# Altium schematic sheet Sheet1.SchDoc
size A4; SheetNumber: 1; SheetTotal: 1
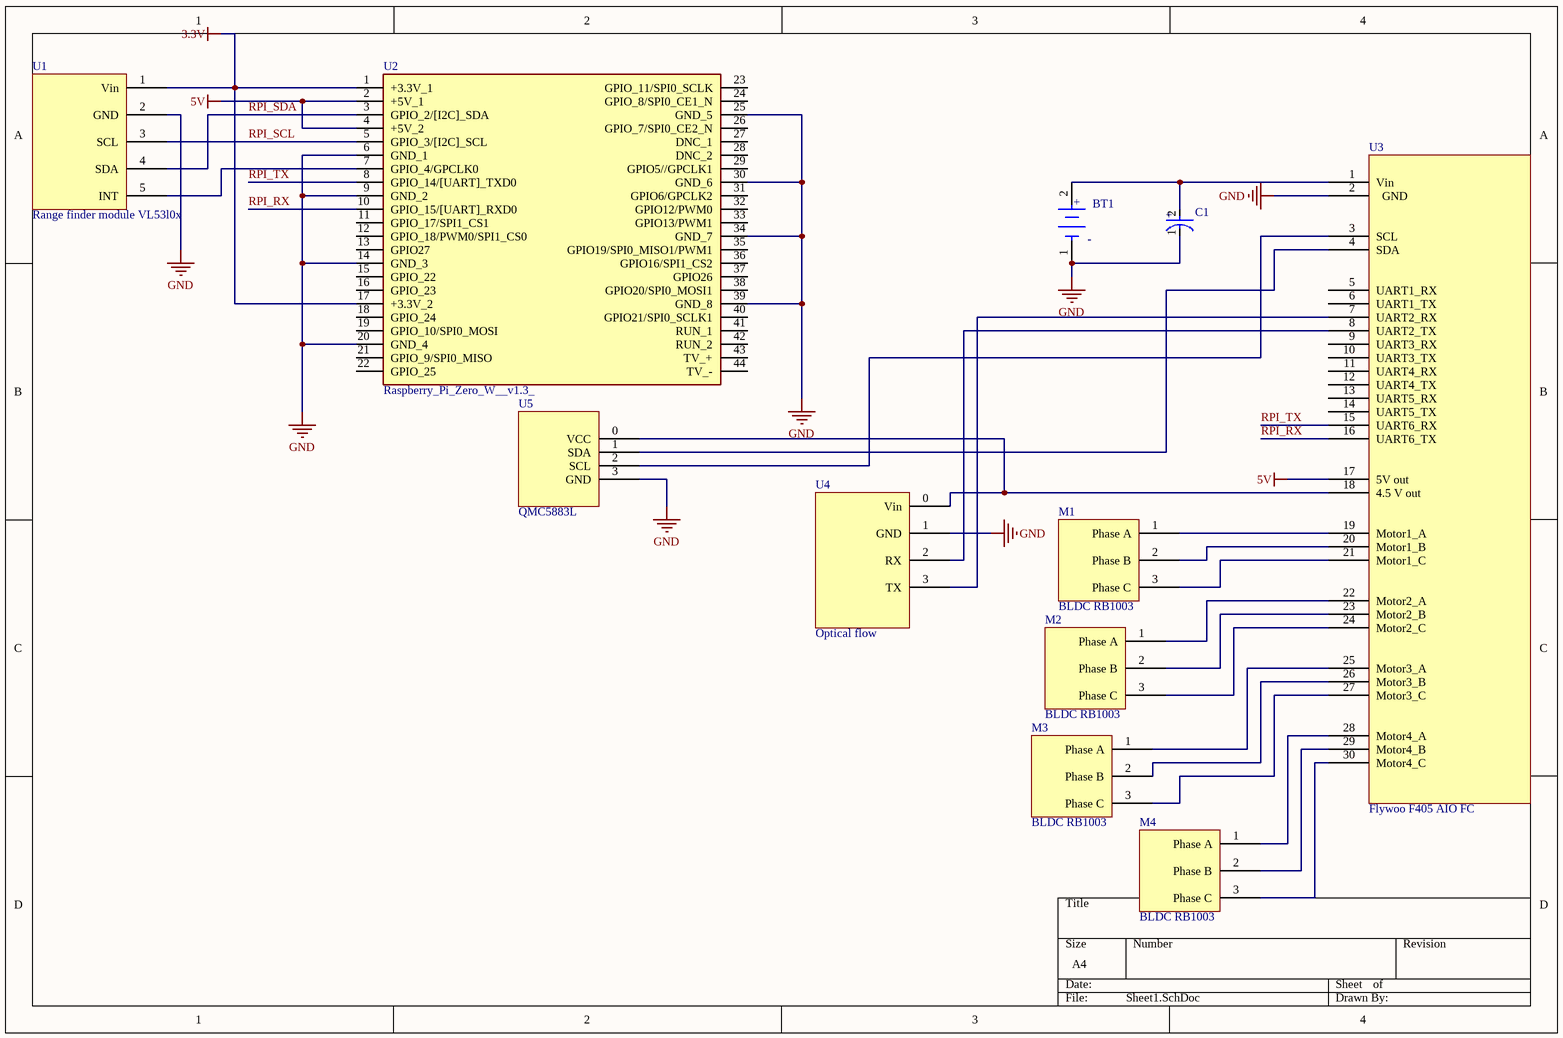
[diagram p0: Sheet1.SchDoc]

## Parts
BT1  S8411-45R  [FP-S8411-45R-MFG]  (value not drawn)
C1  EEEFK1H101P  [FP-FKF-MFG]  (value not drawn)
M1  BLDC RB1003
M2  BLDC RB1003
M3  BLDC RB1003
M4  BLDC RB1003
U1  Range finder module VL53l0x
U2  Raspberry_Pi_Zero_W__v1.3_  [RASPBERRYPIZEROWV13]
U3  Flywoo F405 AIO FC
U4  Optical flow
U5  QMC5883L

## Nets
3.3V: U1.1(Vin) U2.1(+3.3V_1) U2.17(+3.3V_2)
5V: U2.2(+5V_1) U2.4(+5V_2) U3.17(5V_out)
GND: BT1.1(C) C1.1(C) U1.2(GND) U2.6(GND_1) U2.9(GND_2) U2.14(GND_3) U2.20(GND_4) U2.25(GND_5) U2.30(GND_6) U2.34(GND_7) U2.39(GND_8) U3.2(GND) U4.1(GND) U5.3(GND)
RPI_RX: U2.10(GPIO_15/[UART]_RXD0) U3.16(UART6_TX)
RPI_SCL: U1.3(SCL) U2.5(GPIO_3/[I2C]_SCL)
RPI_SDA: U1.4(SDA) U2.3(GPIO_2/[I2C]_SDA)
RPI_TX: U2.8(GPIO_14/[UART]_TXD0) U3.15(UART6_RX)
NetBT1_2: BT1.2(A) C1.2(A) U3.1(Vin)
NetM1_1: M1.1(Phase_A) U3.19(Motor1_A)
NetM1_2: M1.2(Phase_B) U3.20(Motor1_B)
NetM1_3: M1.3(Phase_C) U3.21(Motor1_C)
NetM2_1: M2.1(Phase_A) U3.22(Motor2_A)
NetM2_2: M2.2(Phase_B) U3.23(Motor2_B)
NetM2_3: M2.3(Phase_C) U3.24(Motor2_C)
NetM3_1: M3.1(Phase_A) U3.25(Motor3_A)
NetM3_2: M3.2(Phase_B) U3.26(Motor3_B)
NetM3_3: M3.3(Phase_C) U3.27(Motor3_C)
NetM4_1: M4.1(Phase_A) U3.28(Motor4_A)
NetM4_2: M4.2(Phase_B) U3.29(Motor4_B)
NetM4_3: M4.3(Phase_C) U3.30(Motor4_C)
NetU1_5: U1.5(INT) U2.7(GPIO_4/GPCLK0)
NetU3_3: U3.3(SCL) U5.2(SCL)
NetU3_4: U3.4(SDA) U5.1(SDA)
NetU3_7: U3.7(UART2_RX) U4.3(TX)
NetU3_8: U3.8(UART2_TX) U4.2(RX)
NetU3_18: U3.18(4.5_V_out) U4.0(Vin) U5.0(VCC)

Not connected (* = marked no-connect by the designer): U2 11(GPIO_17/SPI1_CS1) 12(GPIO_18/PWM0/SPI1_CS0) 13(GPIO27) 15(GPIO_22) 16(GPIO_23) 18(GPIO_24) 19(GPIO_10/SPI0_MOSI) 21(GPIO_9/SPI0_MISO) 22(GPIO_25) 23(GPIO_11/SPI0_SCLK) 24(GPIO_8/SPI0_CE1_N) 26(GPIO_7/SPI0_CE2_N) 27(DNC_1) 28(DNC_2) 29(GPIO5//GPCLK1) 31(GPIO6/GPCLK2) 32(GPIO12/PWM0) 33(GPIO13/PWM1) 35(GPIO19/SPI0_MISO1/PWM1) 36(GPIO16/SPI1_CS2) 37(GPIO26) 38(GPIO20/SPI0_MOSI1) 40(GPIO21/SPI0_SCLK1) 41(RUN_1) 42(RUN_2) 43(TV_+) 44(TV_-); U3 5(UART1_RX) 6(UART1_TX) 9(UART3_RX) 10(UART3_TX) 11(UART4_RX) 12(UART4_TX) 13(UART5_RX) 14(UART5_TX)

## Notes on the sheet
- (in symbol CMP-2000-06208-3) +
- (in symbol CMP-15817-000007-1) +; -

## Library data of the parts
BT1 = CMP-15817-000007-1: BATTERY HOLDER COIN 12MM SMD; Number of Batteries: 1; Material: Polyphenylene; Case/Package: SMD/SMT; Number of Cells: 1; Min Operating Temperature: -55°C; Termination: SMD/SMT; REACH SVHC: No SVHC; Contact Plating: Bronze; Package Quantity: 500; Max Operating Temperature: 105°C; Mount: Surface Mount; Packaging: Tape and Reel
C1 = CMP-2000-06208-3: CAP ALUM 100UF 20% 50V SMD; Leakage Current: 3uA; ESR (Equivalent Series Resistance): 340mR; Material: Aluminium; Ripple Current: 350mA; Life (Hours): 2000Hour; Min Operating Temperature: -55°C; Contact Plating: Tin; REACH SVHC: No SVHC; RoHS Compliant: Yes; Width: 10mm; Radiation Hardening: No; Termination: SMD/SMT; Packaging: Tape and Reel; Max Operating Temperature: 105°C; Case/Package: Radial; Voltage Rating: 50V; Length: 10.2mm; Voltage: 50V; Package Quantity: 1; Voltage Rating (DC): 50V; Height - Seated (Max): 0.402inch; Mount: Surface Mount; Impedance: 340mR; Construction: Cylindrical; Height: 10.2mm; Lead Free: Lead Free; Dielectric Material: Aluminium; Series: FK; Tolerance: 20%; Diameter: 8mm; Ripple Current (AC): 350mA; Capacitance: 100uF; Number of Pins: 2
U2 = Raspberry_Pi_Zero_W__v1.3_: Integrated Circuit; Manufacturer_Name: RASPBERRY-PI; Manufacturer_Part_Number: Raspberry Pi Zero W (v1.3); Datasheet Link: https://cdn.sparkfun.com/assets/learn_tutorials/6/7/6/PiZero_1.pdf
U4 = MTF_02 (PMW3901)